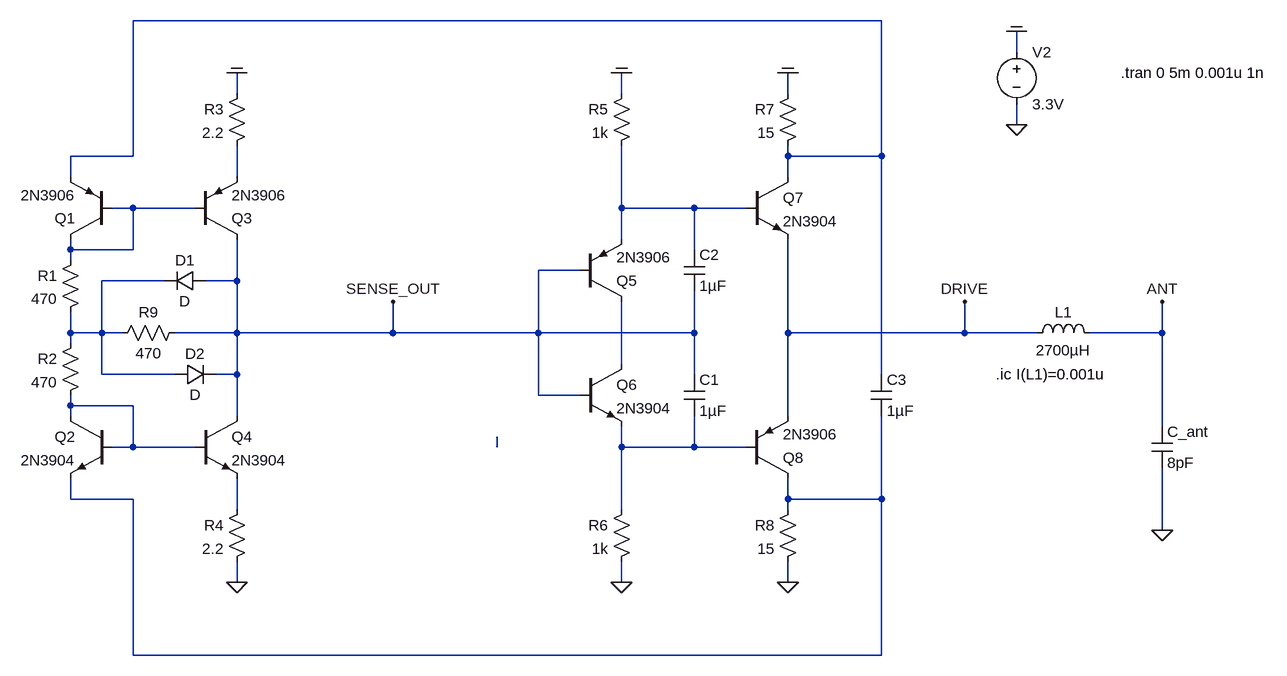
[diagram p0: schematic 2021_current_sensing_8bjts_01.asc]
2021_current_sensing_8bjts_01.asc, the LTspice schematic file:
Version 4
SHEET 1 13280 8692
WIRE 3328 3776 2176 3776
WIRE 3536 3824 3536 3792
WIRE 2336 3888 2336 3856
WIRE 2928 3888 2928 3856
WIRE 3184 3888 3184 3856
WIRE 3536 3936 3536 3904
WIRE 2176 3984 2176 3776
WIRE 2176 3984 2080 3984
WIRE 3184 3984 3184 3968
WIRE 3328 3984 3328 3776
WIRE 3328 3984 3184 3984
WIRE 2080 4016 2080 3984
WIRE 2336 4016 2336 3968
WIRE 3184 4016 3184 3984
WIRE 2176 4064 2144 4064
WIRE 2272 4064 2176 4064
WIRE 2928 4064 2928 3968
WIRE 3040 4064 2928 4064
WIRE 3120 4064 3040 4064
WIRE 2928 4112 2928 4064
WIRE 2080 4128 2080 4112
WIRE 2176 4128 2176 4064
WIRE 2176 4128 2080 4128
WIRE 3040 4128 3040 4064
WIRE 2080 4144 2080 4128
WIRE 2864 4160 2800 4160
WIRE 2224 4176 2128 4176
WIRE 2336 4176 2336 4112
WIRE 2336 4176 2288 4176
WIRE 2080 4256 2080 4224
WIRE 2128 4256 2128 4176
WIRE 2128 4256 2080 4256
WIRE 2160 4256 2128 4256
WIRE 2336 4256 2336 4176
WIRE 2336 4256 2240 4256
WIRE 2576 4256 2576 4208
WIRE 2576 4256 2336 4256
WIRE 2800 4256 2800 4160
WIRE 2800 4256 2576 4256
WIRE 3040 4256 3040 4192
WIRE 3040 4256 2800 4256
WIRE 3184 4256 3184 4112
WIRE 3456 4256 3456 4208
WIRE 3456 4256 3184 4256
WIRE 3568 4256 3456 4256
WIRE 3760 4256 3760 4208
WIRE 3760 4256 3648 4256
WIRE 2080 4272 2080 4256
WIRE 2928 4304 2928 4208
WIRE 2128 4320 2128 4256
WIRE 2240 4320 2128 4320
WIRE 2336 4320 2336 4256
WIRE 2336 4320 2304 4320
WIRE 3040 4320 3040 4256
WIRE 3328 4320 3328 3984
WIRE 2800 4352 2800 4256
WIRE 2864 4352 2800 4352
WIRE 2080 4368 2080 4352
WIRE 2176 4368 2080 4368
WIRE 2080 4384 2080 4368
WIRE 2336 4384 2336 4320
WIRE 3184 4384 3184 4256
WIRE 3760 4400 3760 4256
WIRE 2176 4432 2176 4368
WIRE 2176 4432 2144 4432
WIRE 2272 4432 2176 4432
WIRE 2736 4432 2736 4416
WIRE 2928 4432 2928 4400
WIRE 3040 4432 3040 4384
WIRE 3040 4432 2928 4432
WIRE 3120 4432 3040 4432
WIRE 2080 4512 2080 4480
WIRE 2176 4512 2080 4512
WIRE 3184 4512 3184 4480
WIRE 3328 4512 3328 4384
WIRE 3328 4512 3184 4512
WIRE 2336 4528 2336 4480
WIRE 2928 4528 2928 4432
WIRE 3184 4528 3184 4512
WIRE 3760 4560 3760 4464
WIRE 2336 4640 2336 4608
WIRE 2928 4640 2928 4608
WIRE 3184 4640 3184 4608
WIRE 2176 4752 2176 4512
WIRE 3328 4752 3328 4512
WIRE 3328 4752 2176 4752
FLAG 3536 3936 0
FLAG 3536 3792 COM
FLAG 2336 4640 0
FLAG 2336 3856 COM
FLAG 3760 4560 0
FLAG 3760 4208 ANT
FLAG 3456 4208 DRIVE
FLAG 2928 4640 0
FLAG 3184 4640 0
FLAG 2928 3856 COM
FLAG 3184 3856 COM
FLAG 2576 4208 SENSE_OUT
SYMBOL voltage 3536 3808 R0
WINDOW 123 0 0 Left 2
WINDOW 39 0 0 Left 2
SYMATTR InstName V2
SYMATTR Value 3.3V
SYMBOL npn 2272 4384 R0
SYMATTR InstName Q4
SYMATTR Value 2N3904
SYMBOL pnp 2272 4112 M180
SYMATTR InstName Q3
SYMATTR Value 2N3906
SYMBOL npn 2144 4384 M0
SYMATTR InstName Q2
SYMATTR Value 2N3904
SYMBOL pnp 2144 4112 R180
SYMATTR InstName Q1
SYMATTR Value 2N3906
SYMBOL res 2352 4512 M0
WINDOW 0 36 40 Left 2
WINDOW 3 36 76 Left 2
SYMATTR InstName R4
SYMATTR Value 2.2
SYMBOL res 2352 3872 M0
WINDOW 0 36 40 Left 2
WINDOW 3 36 76 Left 2
SYMATTR InstName R3
SYMATTR Value 2.2
SYMBOL res 2096 4128 M0
WINDOW 0 36 40 Left 2
WINDOW 3 36 76 Left 2
SYMATTR InstName R1
SYMATTR Value 470
SYMBOL res 2096 4256 M0
WINDOW 0 36 40 Left 2
WINDOW 3 36 76 Left 2
SYMATTR InstName R2
SYMATTR Value 470
SYMBOL ind 3552 4272 R270
WINDOW 0 32 56 VTop 2
WINDOW 3 5 56 VBottom 2
SYMATTR InstName L1
SYMATTR Value 2700µH
SYMATTR SpiceLine Rser=120 Cpar=1.2pF
SYMBOL cap 3744 4400 R0
SYMATTR InstName C_ant
SYMATTR Value 8pF
SYMBOL npn 3120 4016 R0
SYMATTR InstName Q7
SYMATTR Value 2N3904
SYMBOL pnp 3120 4480 M180
SYMATTR InstName Q8
SYMATTR Value 2N3906
SYMBOL npn 2864 4304 R0
SYMATTR InstName Q6
SYMATTR Value 2N3904
SYMBOL pnp 2864 4208 M180
SYMATTR InstName Q5
SYMATTR Value 2N3906
SYMBOL res 2944 4512 M0
WINDOW 0 36 40 Left 2
WINDOW 3 36 76 Left 2
SYMATTR InstName R6
SYMATTR Value 1k
SYMBOL res 3200 4512 M0
WINDOW 0 36 40 Left 2
WINDOW 3 36 76 Left 2
SYMATTR InstName R8
SYMATTR Value 15
SYMBOL res 2944 3872 M0
WINDOW 0 36 40 Left 2
WINDOW 3 36 76 Left 2
SYMATTR InstName R5
SYMATTR Value 1k
SYMBOL res 3200 3872 M0
WINDOW 0 36 40 Left 2
WINDOW 3 36 76 Left 2
SYMATTR InstName R7
SYMATTR Value 15
SYMBOL cap 3312 4320 R0
SYMATTR InstName C3
SYMATTR Value 1µF
SYMBOL res 2256 4240 R90
WINDOW 0 0 56 VBottom 2
WINDOW 3 32 56 VTop 2
SYMATTR InstName R9
SYMATTR Value 470
SYMBOL diode 2288 4160 R90
WINDOW 0 0 32 VBottom 2
WINDOW 3 32 32 VTop 2
SYMATTR InstName D1
SYMBOL diode 2240 4336 R270
WINDOW 0 32 32 VTop 2
WINDOW 3 0 32 VBottom 2
SYMATTR InstName D2
SYMBOL cap 3024 4320 R0
SYMATTR InstName C1
SYMATTR Value 1µF
SYMBOL cap 3024 4128 R0
SYMATTR InstName C2
SYMATTR Value 1µF
TEXT 3696 3856 Left 2 !.tran 0 5m 0.001u 1n
TEXT 3504 4320 Left 2 !.ic I(L1)=0.001u

The netlist it stands for:
* 2021_current_sensing_8bjts_01.asc
V2 COM 0 3.3V
Q4 SENSE_OUT N007 N011 0 2N3904
Q3 SENSE_OUT N003 N002 0 2N3906
Q2 N007 N007 N010 0 2N3904
Q1 N003 N003 N001 0 2N3906
R4 N011 0 2.2
R3 COM N002 2.2
R1 N003 N005 470
R2 N005 N007 470
L1 DRIVE ANT 2700µH Rser=120 Cpar=1.2pF
C_ant ANT 0 8pF
Q7 N001 N004 DRIVE 0 2N3904
Q8 N010 N009 DRIVE 0 2N3906
Q6 N006 SENSE_OUT N009 0 2N3904
Q5 N006 SENSE_OUT N004 0 2N3906
R6 N009 0 1k
R8 N010 0 15
R5 COM N004 1k
R7 COM N001 15
C3 N001 N010 1µF
R9 SENSE_OUT N005 470
D1 SENSE_OUT N005 D
D2 N005 SENSE_OUT D
C1 SENSE_OUT N009 1µF
C2 N004 SENSE_OUT 1µF
.model D D
.lib standard.dio
.model NPN NPN
.model PNP PNP
.lib standard.bjt
.tran 0 5m 0.001u 1n
.ic I(L1)=0.001u
.backanno
.end